# EAGLE schematic Easel_circuit_samples (EAGLE 9.5.2)

## Sheet 1 of 2: CV Input
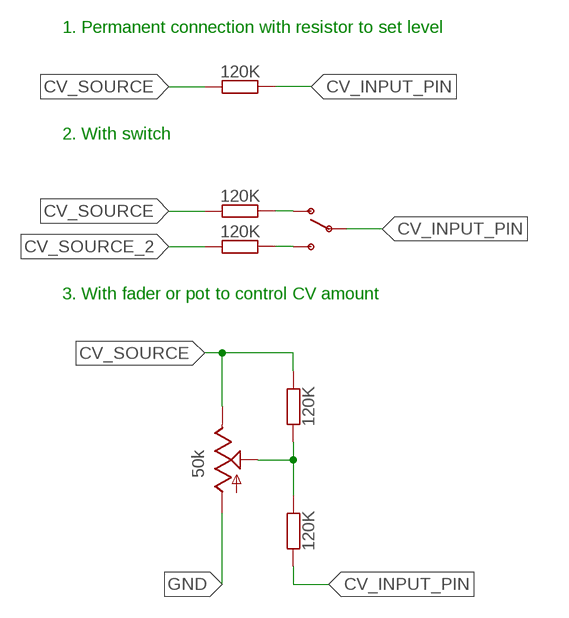
[diagram p0: schematic, sheet 1]

### Parts
R1  120K  RESISTOR-0603  [C0603]
R2  120K  RESISTOR-0603  [C0603]
R3  120K  RESISTOR-0603  [C0603]
R4  120K  RESISTOR-0603  [C0603]
R5  120K  RESISTOR-0603  [C0603]
S1  GRAYHILL_34E_SMD_TOGGLE  [34EWMSP12M6RT]
VR1  50k  9MM_SNAP-IN_POT_  [9MM_SNAP-IN_POT]

### Nets
CV_INPUT_PIN: R2.1 R3.1 S1.2(COMMON)
CV_SOURCE: R1.2 R3.2 R4.2 VR1.3(E)
CV_SOURCE_2: R5.2
GND: VR1.1(A) ; also sheet 2
N$1: R4.1 S1.1(O)
N$2: R1.1 R2.2 VR1.2(S)
N$3: R5.1 S1.3(S)

### Notes on the sheet
- 1. Permanent connection with resistor to set level
- 2. With switch
- 3. With fader or pot to control CV amount

## Sheet 2 of 2: Pulse Input
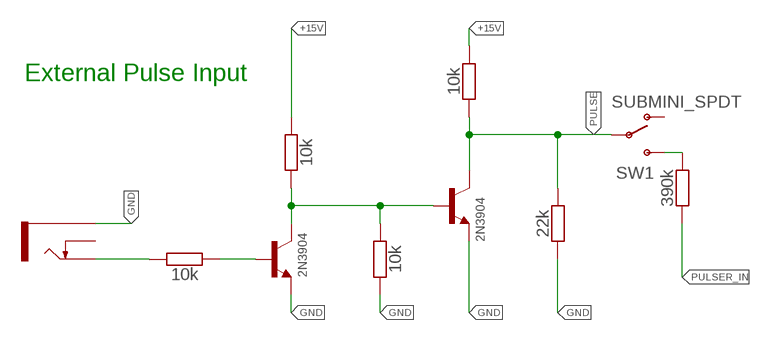
[diagram p1: schematic, sheet 2]

### Parts
Q1  2N3904  TRANS_NPN_DUAL-MBT3904DW1T1  [SC70-6]
R6  10k  RESISTOR-0603  [C0603]
R7  10k  RESISTOR-0603  [C0603]
R8  10k  RESISTOR-0603  [C0603]
R9  10k  RESISTOR-0603  [C0603]
R10  22k  RESISTOR-0603  [C0603]
R11  390k  RESISTOR-0603  [C0603]
SW1  SUBMINI_SPDT  [SUBMINI_TOGGLE]
U1  THONKICONNNEW  [WQP-PJ301M-12_JACK]

### Nets
+15V: R7.2 R9.1
GND: Q1.1(Q2:E) Q1.4(Q1:E) R8.1 R10.2 U1.P$3_SLEEVE(SLEEVE) ; also sheet 1
N$4: R6.1 U1.P$1_TIP(TIP)
N$5: Q1.5(Q1:B) R6.2
N$6: Q1.2(Q2:B) Q1.3(Q1:C) R7.1 R8.2
N$7: R11.1 SW1.3(S)
PULSE: Q1.6(Q2:C) R9.2 R10.1 SW1.COM(COMMON)
PULSER_IN: R11.2
Unconnected: SW1.1(O) U1.P$2_SWITCH(SWITCH)

### Notes on the sheet
- External Pulse Input

## Library data of the parts
Q1 = SparkFun-DiscreteSemi:TRANS_NPN_DUAL: Dual NPN Transistors in Single Package The MBT3904W1 puts two general purpose 3904 NPN transistors in a single package. Datasheet <http://www.onsemi.com/pub_link/Collateral/MBT3904DW1T1-D.PDF> SparkFun Products: SparkFun ESP32 Thing <https://www.sparkfun.com/products/13907>; PROD_ID: TRANS-13337
R1-R11 = we-rcl:RESISTOR: Resistors all kinds in 0402 and 0603
S1 = MTM_untested:GRAYHILL_34E_SMD_TOGGLE: Toggle Switches Toggle Switch SPDT ON-NONE-ON Source: Datasheet <https://componentsearchengine.com/Datasheets/1/34EWMSP12M6RT.pdf>; ARROW_PART_NUMBER: 34EWMSP12M6RT; ARROW_PRICE-STOCK: https://www.arrow.com/en/products/34ewmsp12m6rt/grayhill; DESCRIPTION: Toggle Switches Toggle Switch SPDT ON-NONE-ON; HEIGHT: 6mm; MANUFACTURER_NAME: Grayhill; MANUFACTURER_PART_NUMBER: 34EWMSP12M6RT; MOUSER_PART_NUMBER: 706-34EWMSP12M6RT; MOUSER_PRICE-STOCK: https://www.mouser.co.uk/ProductDetail/Grayhill/34EWMSP12M6RT?qs=ls7QRyWmRk4NaHZ1L237nQ%3D%3D
SW1 = MusicThingModular:SUBMINI_SPDT
U1 = MusicThingModular:THONKICONN: 3.5mm socket for Eurorack modular synths
VR1 = MusicThingModular:9MM_SNAP-IN_POT: 9mm vertical snap-in pot, Alpha / Panasonic style